# EasyEDA schematic PwrPiSchematics.json
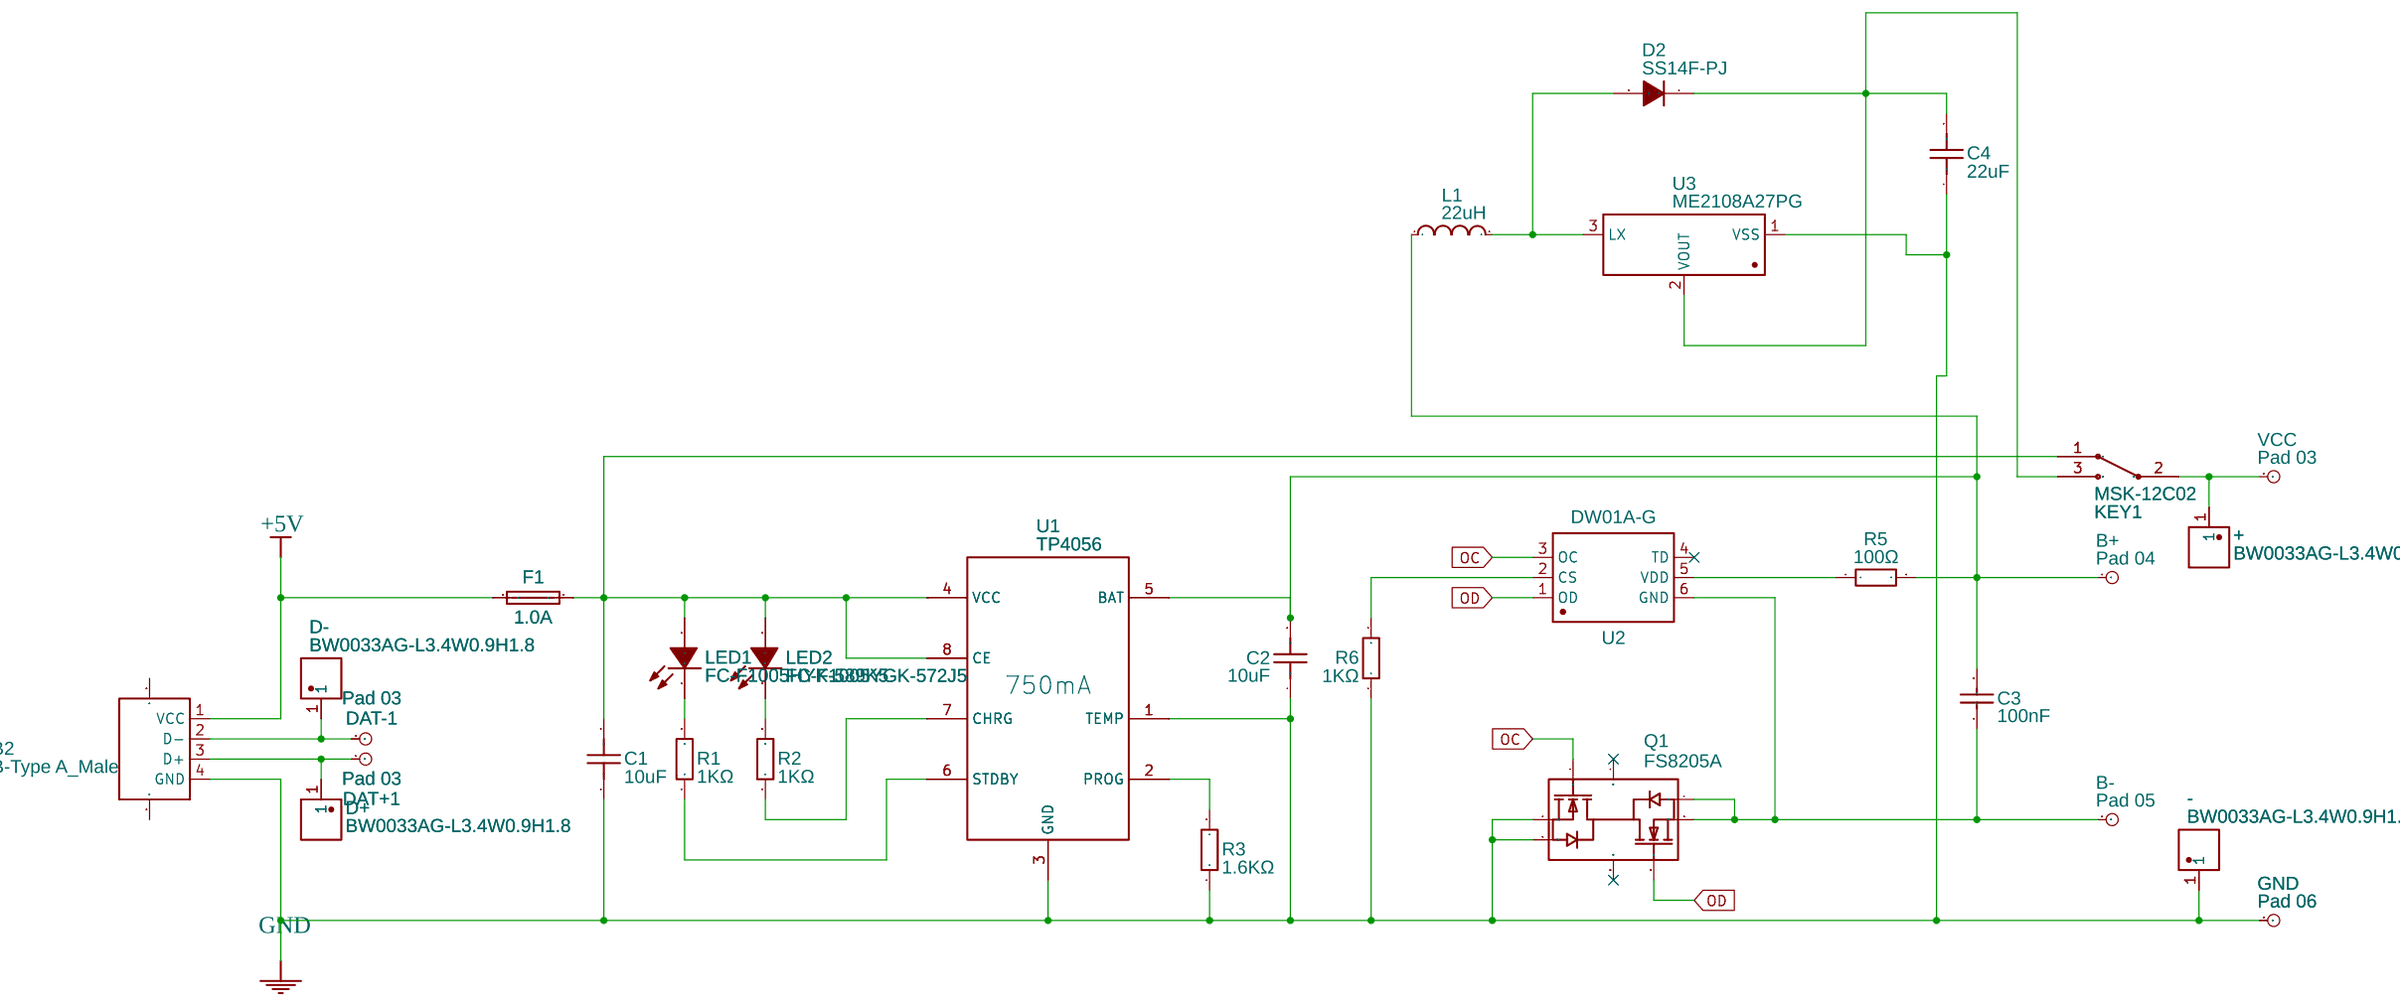
[diagram p0: schematic sheet]

## Parts
+  BW0033AG-L3.4W0.9H1.8  [TESTPOINT-SMD_L3.4-W0.9_BW0033AG]
-  BW0033AG-L3.4W0.9H1.8  [TESTPOINT-SMD_L3.4-W0.9_BW0033AG]
B+  Pad 04  [CON_PAD_SQUARE_32MIL]
B-  Pad 05  [CON_PAD_SQUARE_32MIL]
C1  10uF  [C0603]
C2  10uF  [C0603]
C3  100nF  [C0402]
C4  22uF  [C0603]
D2  SS14F-PJ  [SMAF_L3.5-W2.6-LS4.7-RD]
D+  BW0033AG-L3.4W0.9H1.8  [TESTPOINT-SMD_L3.4-W0.9_BW0033AG]
D-  BW0033AG-L3.4W0.9H1.8  [TESTPOINT-SMD_L3.4-W0.9_BW0033AG]
DAT+1  Pad 03  [CON_PAD_SQUARE_32MIL]
DAT-1  Pad 03  [CON_PAD_SQUARE_32MIL]
F1  1.0A  [F0603]
GND  Pad 06  [CON_PAD_SQUARE_32MIL]
KEY1  MSK-12C02  [MSK-11027]
L1  22uH  [IND-SMD_L3.5-W3.0]
LED1  FC-F1005HYK-589K5  [LED0402-RD]
LED2  FC-F1005YGK-572J5  [LED0402-RD]
Q1  FS8205A  [TSSOP-8_L4.4-W3.5-P0.65-LS6.4-BL]
R1  1KΩ  [R0402]
R2  1KΩ  [R0402]
R3  1.6KΩ  [R0603]
R5  100Ω  [R0603]
R6  1KΩ  [R0402]
U1  TP4056  [SOP-8_EP_150MIL]
U2  DW01A-G  [SOT-23-6]
U3  ME2108A27PG  [SOT-89-3_L4.5-W2.5-P1.50-LS4.2-BR]
USB2  USB-Type A_Male  [USB-A-TH_48037-0001]
VCC  Pad 03  [CON_PAD_SQUARE_32MIL]

## Library data of the parts
+ - D+ D- = BW0033AG-L3.4W0.9H1.8: Supplier: LCSC; Supplier Part: C2826530; Manufacturer: BAT WIRELESS(蝙蝠无线); JLCPCB Part Class: Extended Part; Contributor: LCSC
B+ B- DAT+1 DAT-1 GND VCC = -: Contributor: DangerousPrototype; Manufacturer Part: ?
C1 C2 = CL10A106MA8NRNC: Supplier: LCSC; Manufacturer: SAMSUNG; Supplier Part: C96446; LCSC Assembly: Yes; SMT Type: Extend
C3 = CL05B104KO5NNNC: Supplier: LCSC; Manufacturer: SAMSUNG; LCSC Assembly: Yes; Supplier Part: C1525; SMT Type: Basic
C4 = GRM188R60J226MEA0D: Supplier: LCSC; Manufacturer: muRata(村田); Supplier Part: C77042; JLCPCB Part Class: Extended Part
D2 = SS14F-PJ: Supplier: LCSC; Supplier Part: C510722; Manufacturer: PJSEMI(平晶微); Contributor: LCSC; JLCPCB Part Class: Extended Part
F1 = CFS06V3T1R0: Supplier: LCSC; Supplier Part: C163118; Manufacturer: TA-I Tech; Contributor: LCSC; LCSC Assembly: Yes; SMT Type: Extend
KEY1 = MSK-12C02: Supplier: LCSC; Manufacturer: SHOU HAN; Manufacturer Part: MSK12C02; Supplier Part: C431540; Contributor: kitkatoishi
L1 = SM3521-220MT: Supplier: LCSC; Manufacturer: SXN(顺翔诺); Supplier Part: C68387; JLCPCB Part Class: Extended Part
LED1 = FC-F1005HYK-589K5: Supplier: LCSC; Manufacturer: NATIONSTAR; Contributor: LCSC; Supplier Part: C130721; JLCPCB Part Class: Extended Part
LED2 = FC-F1005YGK-572J5: Supplier: LCSC; Manufacturer: 国星光电; Manufacturer Part: NCD0402C1; Contributor: LCSC; Supplier Part: C130722; JLCPCB Part Class: Extended Part
Q1 = -: Supplier: LCSC; Manufacturer: FORTUNE; LCSC Assembly: Yes; image: //image.lceda.cn/szlcsc/C16052.jpg; Supplier Part: C16052
R1 R2 R6 = 0402WGF1001TCE: Supplier: LCSC; Manufacturer: UniOhm; LCSC Assembly: Yes; Supplier Part: C11702; SMT Type: Basic
R3 = 0603WAF1601T5E: Supplier: LCSC; Manufacturer: UniOhm; Supplier Part: C22847; LCSC Assembly: Yes; SMT Type: Extend
R5 = 0603WAF1000T5E: Supplier: LCSC; Manufacturer: UniOhm; LCSC Assembly: Yes; Supplier Part: C22775; SMT Type: Basic
U1 = -: Contributor: Guest; Supplier: LCSC; Manufacturer: TOPPOWER; LCSC Assembly: Yes; image: //image.lceda.cn/szlcsc/C16581.jpg; Supplier Part: C16581
U2 = -: Supplier: LCSC; Manufacturer: FORTUNE; Contributor: LCSC; Supplier Part: C61503; Package Display: No
U3 = ME2108A27PG: Supplier: LCSC; Supplier Part: C236808; Manufacturer: Nanjing Micro One Elec; Contributor: LCSC; JLCPCB Part Class: Extended Part
USB2 = USB-Type A_Male: Supplier Part: C112454; Supplier: LCSC; Manufacturer: SOFNG; Manufacturer Part: USB-05; Contributor: LCEDA_Lib

## Nets
+5V: F1.1 USB2.1(VCC)
GND: -.1 C1.1 C2.1 C4.1 GND.P Q1.2(S1) Q1.3(S1) R3.1 R6.1 U1.1(TEMP) U1.3(GND) U3.1(VSS) USB2.4(GND)
OC: Q1.4(G1) U2.3(OC)
OD: Q1.5(G2) U2.1(OD)
Net-(+-1): +.1 KEY1.2 VCC.P
Net-(B+-P): B+.P C2.2 C3.2 L1.1 R5.2 U1.5(BAT)
Net-(B--P): B-.P C3.1 Q1.6(S2) Q1.7(S2) U2.6(GND)
Net-(C1-2): C1.2 F1.2 KEY1.1 LED1.2(A) LED2.2(A) U1.4(VCC) U1.8(CE)
Net-(C4-2): C4.2 D2.1(K) KEY1.3 U3.2(VOUT)
Net-(D2-2): D2.2(A) L1.2 U3.3(LX)
Net-(D+-1): D+.1 DAT+1.P USB2.3(D+)
Net-(D--1): D-.1 DAT-1.P USB2.2(D-)
Net-(LED1-1): LED1.1(K) R1.2
Net-(LED2-1): LED2.1(K) R2.2
Net-(R1-1): R1.1 U1.6(STDBY)
Net-(R2-1): R2.1 U1.7(CHRG)
Net-(R3-2): R3.2 U1.2(PROG)
Net-(R5-1): R5.1 U2.5(VDD)
Net-(R6-2): R6.2 U2.2(CS)

Not connected (* = marked no-connect by the designer): Q1 1(D12)* 8(D12)*; U2 4(TD)*; USB2 5 6

## Notes on the sheet
- 750mA
